# Altium project TIDA_050024.PrjPcb (part 1 of 3)
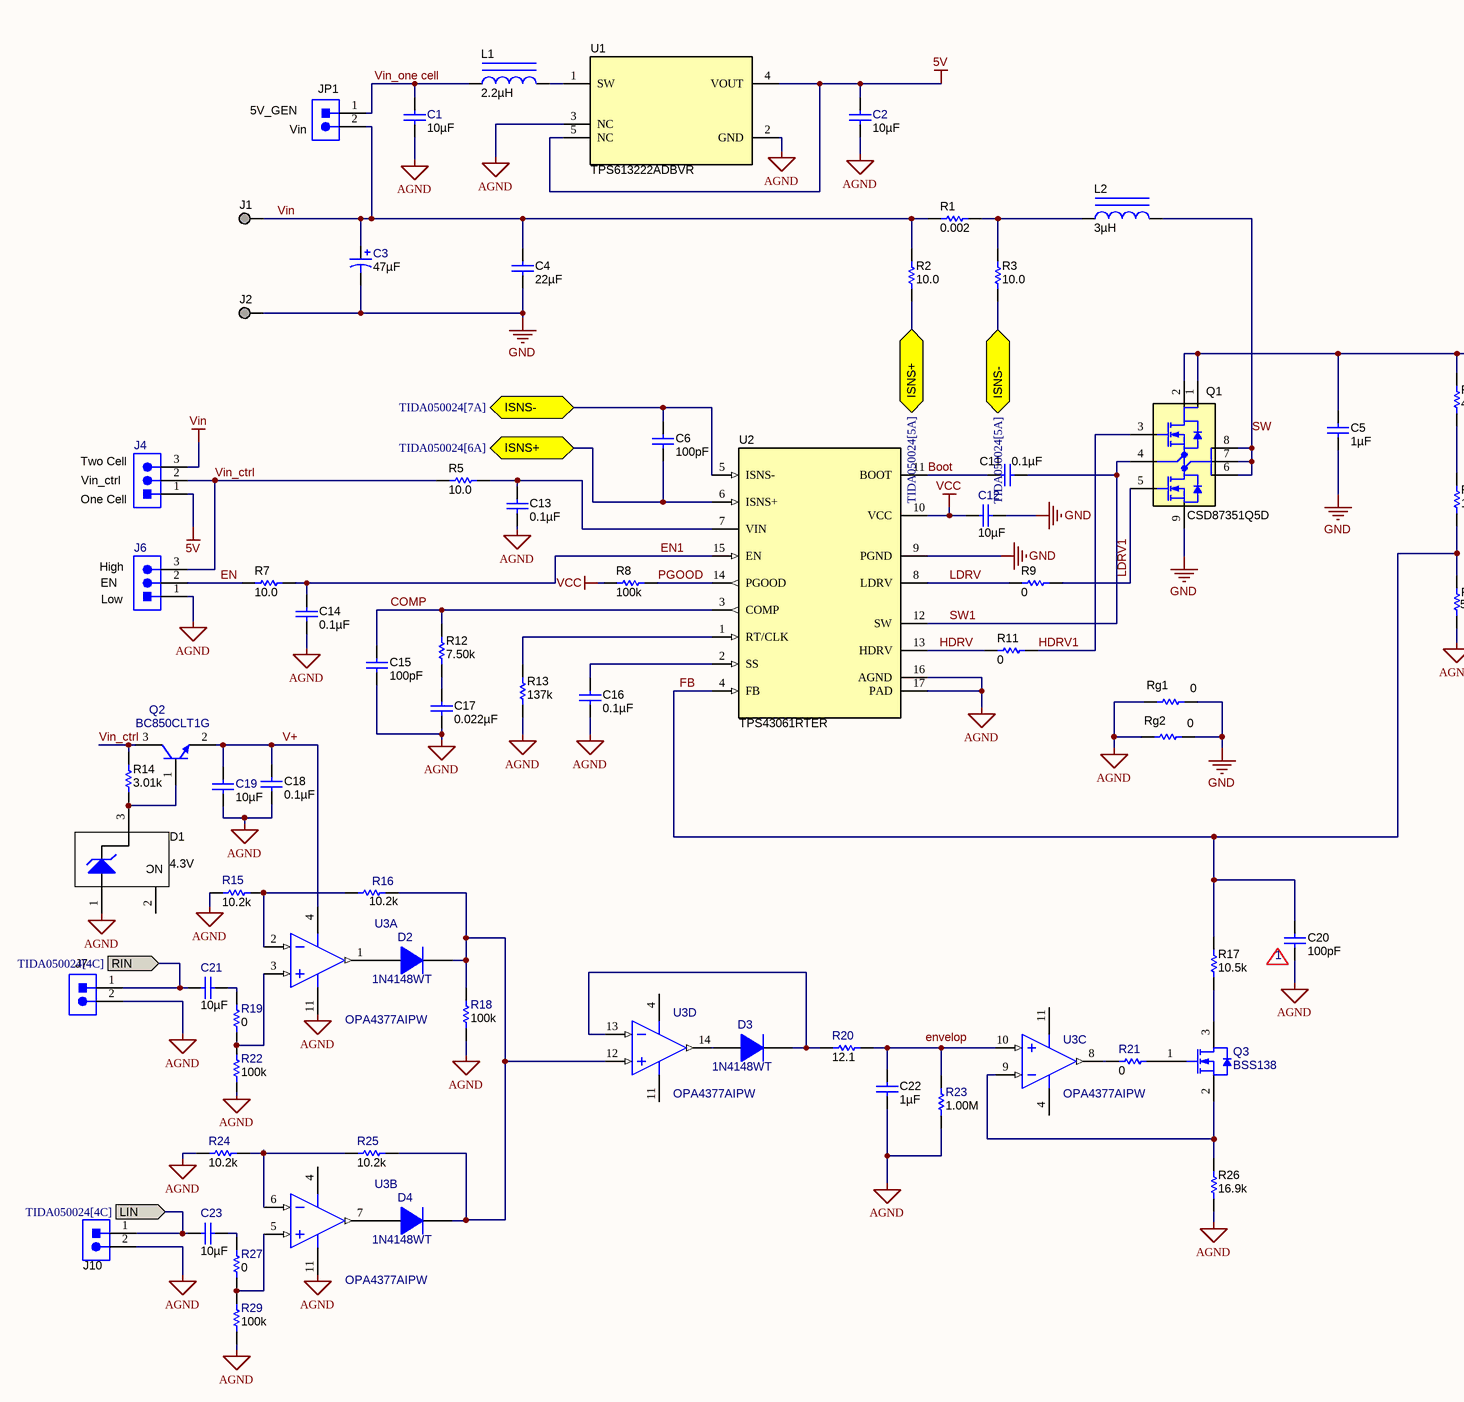
[diagram p0: TIDA050024.SchDoc, top middle]
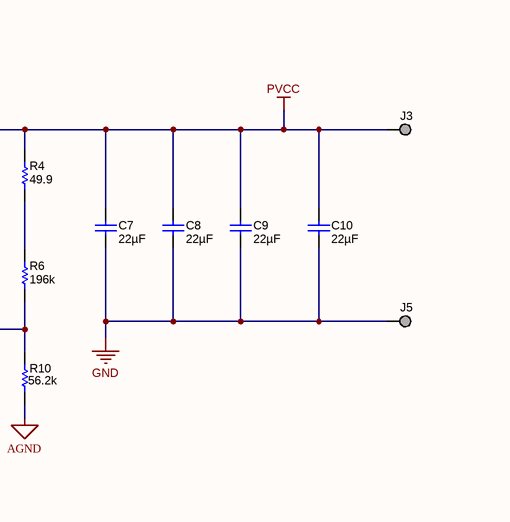
[diagram p1: TIDA050024.SchDoc, top right]
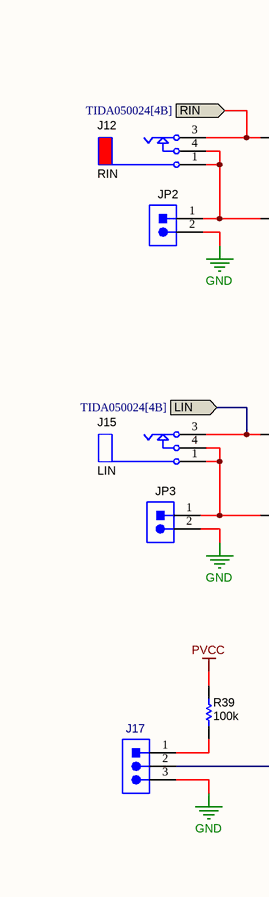
[diagram p2: TIDA050024.SchDoc, bottom left]
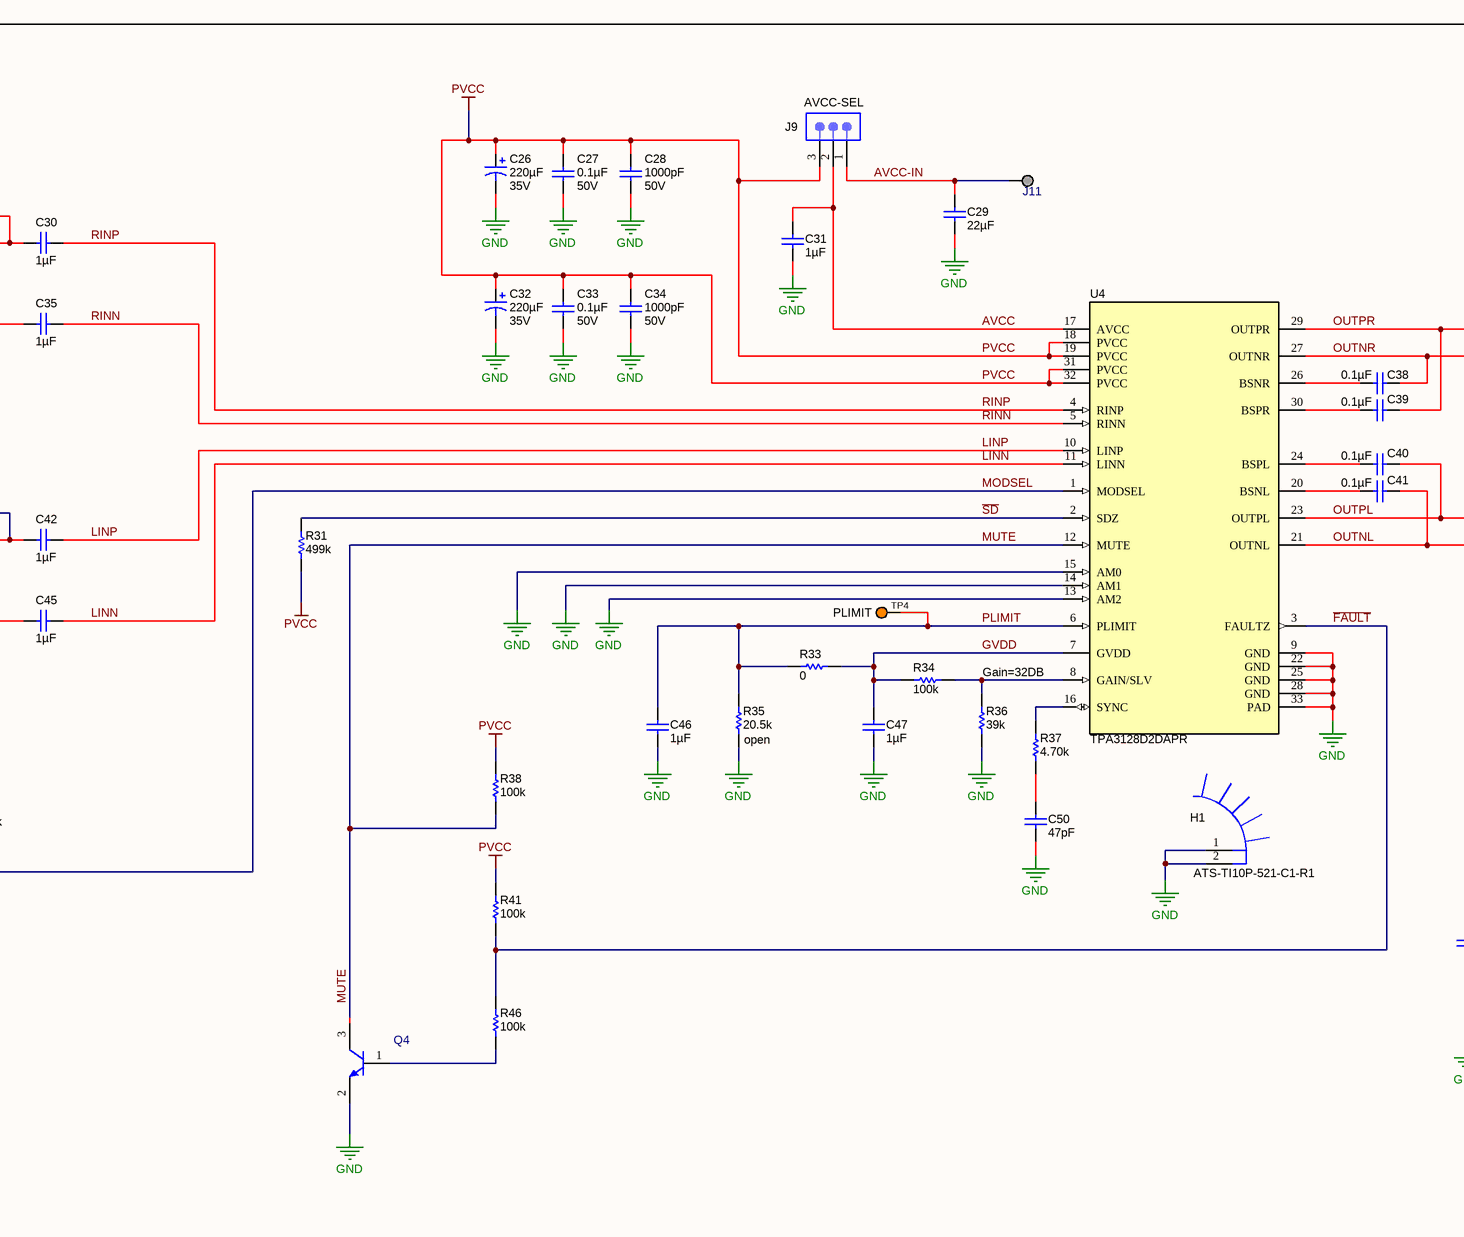
[diagram p3: TIDA050024.SchDoc, bottom middle]
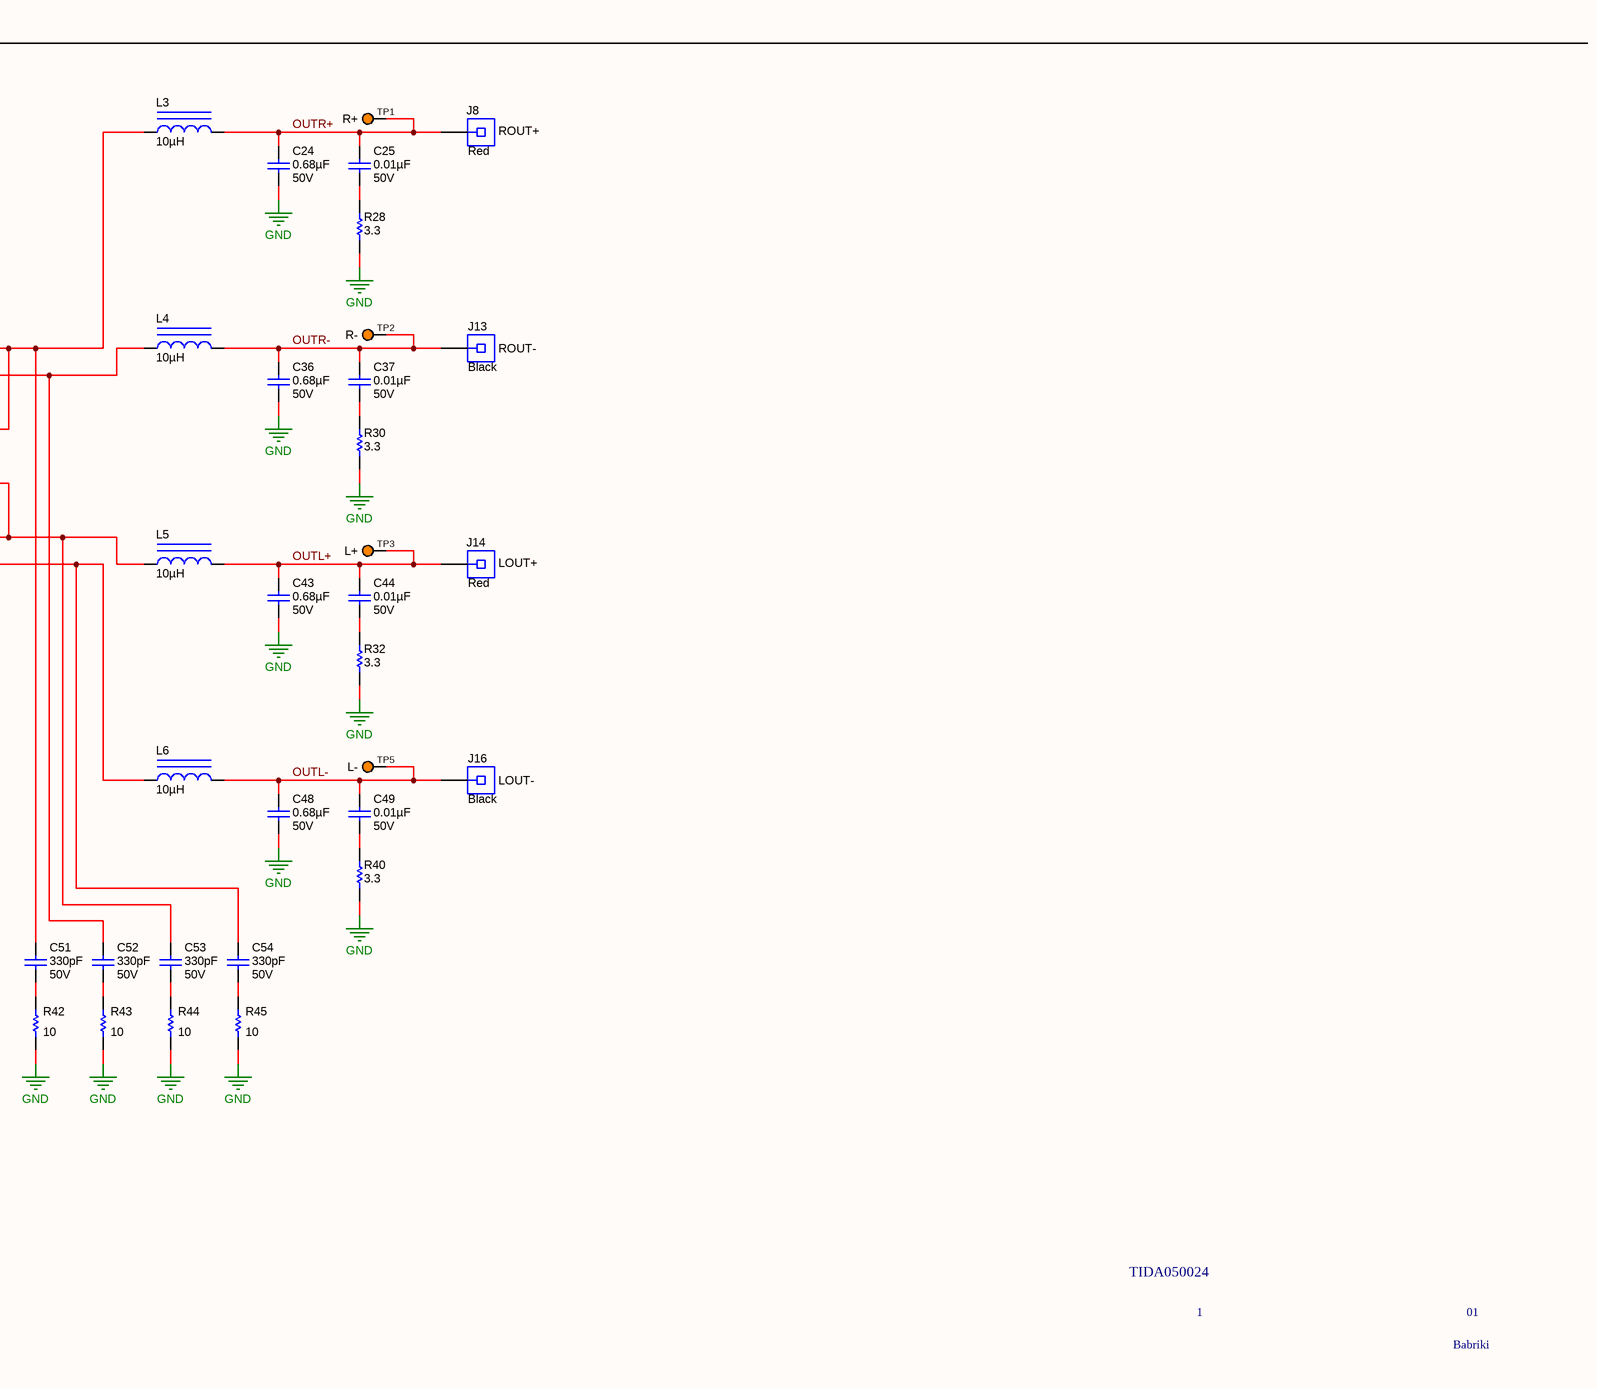
[diagram p4: TIDA050024.SchDoc, bottom right]
1 sheet, 146 parts. Net scope: flat (ports and power ports of the same name join across sheets).
Board file: TIDA050024.PcbDoc

## Sheet TIDA050024.SchDoc
size A1; SheetNumber: 1; SheetTotal: 1

### Parts
C1  ValueDisplayed: 10µF  [0603]  (hidden comment: GRM188R61E106MA73D)
C2  ValueDisplayed: 10µF  [0603]  (hidden comment: GRM188R61E106MA73D)
C3  ValueDisplayed: 47µF  [7343-31]  (hidden comment: T495D476M025ATE120)
C4  ValueDisplayed: 22µF  [1210_270]  (hidden comment: GRM32ER61E226KE15L)
C5  ValueDisplayed: 1µF  [0402]  (hidden comment: C1005X5R1E105K050BC)
C6  ValueDisplayed: 100pF  [0402]  (hidden comment: GRM1555C1H101JA01D)
C7  ValueDisplayed: 22µF  [1210_270]  (hidden comment: GRM32ER61E226KE15L)
C8  ValueDisplayed: 22µF  [1210_270]  (hidden comment: GRM32ER61E226KE15L)
C9  ValueDisplayed: 22µF  [1210_270]  (hidden comment: GRM32ER61E226KE15L)
C10  ValueDisplayed: 22µF  [1210_270]  (hidden comment: GRM32ER61E226KE15L)
C11  ValueDisplayed: 0.1µF  [0402]  (hidden comment: CGA2B3X7R1H104K050BB)
C12  ValueDisplayed: 10µF  [0603]  (hidden comment: GRM188R61E106MA73D)
C13  ValueDisplayed: 0.1µF  [0402]  (hidden comment: CGA2B3X7R1H104K050BB)
C14  ValueDisplayed: 0.1µF  [0402]  (hidden comment: CGA2B3X7R1H104K050BB)
C15  ValueDisplayed: 100pF  [0402]  (hidden comment: GRM1555C1H101JA01D)
C16  ValueDisplayed: 0.1µF  [0402]  (hidden comment: CGA2B3X7R1H104K050BB)
C17  ValueDisplayed: 0.022µF  [0402]  (hidden comment: GCM155R71E223KA55D)
C18  ValueDisplayed: 0.1µF  [0402]  (hidden comment: CGA2B3X7R1H104K050BB)
C19  ValueDisplayed: 10µF  [0603]  (hidden comment: GRM188R61E106MA73D)
C20  ValueDisplayed: 100pF  [0402]  (hidden comment: GRM1555C1H101JA01D)
C21  ValueDisplayed: 10µF  [0603]  (hidden comment: GRM188R61E106MA73D)
C22  ValueDisplayed: 1µF  [0402]  (hidden comment: C1005X5R1E105K050BC)
C23  ValueDisplayed: 10µF  [0603]  (hidden comment: GRM188R61E106MA73D)
C24  ValueDisplayed: 0.68µF  Value2: 50V  [1206L]  (hidden comment: GRM31MR71H684KA88L)
C25  ValueDisplayed: 0.01µF  Value2: 50V  [0603L]  (hidden comment: GRM188R71H103KA01D)
C26  ValueDisplayed: 220µF  Value2: 35V  [FC_1000x1250]  (hidden comment: EEU-FC1V221)
C27  ValueDisplayed: 0.1µF  Value2: 50V  [0603L]  (hidden comment: GCM188R71H104KA57D)
C28  ValueDisplayed: 1000pF  Value2: 50V  [0603L]  (hidden comment: GRM1885C1H102JA01D)
C29  ValueDisplayed: 22µF  [1210_270]  (hidden comment: GRM32ER61E226KE15L)
C30  ValueDisplayed: 1µF  [0603]  (hidden comment: GRM188R61E105KA12D)
C31  ValueDisplayed: 1µF  [0603]  (hidden comment: GRM188R61E105KA12D)
C32  ValueDisplayed: 220µF  Value2: 35V  [FC_1000x1250]  (hidden comment: EEU-FC1V221)
C33  ValueDisplayed: 0.1µF  Value2: 50V  [0603L]  (hidden comment: GCM188R71H104KA57D)
C34  ValueDisplayed: 1000pF  Value2: 50V  [0603L]  (hidden comment: GRM1885C1H102JA01D)
C35  ValueDisplayed: 1µF  [0603]  (hidden comment: GRM188R61E105KA12D)
C36  ValueDisplayed: 0.68µF  Value2: 50V  [1206L]  (hidden comment: GRM31MR71H684KA88L)
C37  ValueDisplayed: 0.01µF  Value2: 50V  [0603L]  (hidden comment: GRM188R71H103KA01D)
C38  ValueDisplayed: 0.1µF  [0603L]  (hidden comment: GCM188R71H104KA57D)
C39  ValueDisplayed: 0.1µF  [0603L]  (hidden comment: GCM188R71H104KA57D)
C40  ValueDisplayed: 0.1µF  [0603L]  (hidden comment: GCM188R71H104KA57D)
C41  ValueDisplayed: 0.1µF  [0603L]  (hidden comment: GCM188R71H104KA57D)
C42  ValueDisplayed: 1µF  [0603]  (hidden comment: GRM188R61E105KA12D)
C43  ValueDisplayed: 0.68µF  Value2: 50V  [1206L]  (hidden comment: GRM31MR71H684KA88L)
C44  ValueDisplayed: 0.01µF  Value2: 50V  [0603L]  (hidden comment: GRM188R71H103KA01D)
C45  ValueDisplayed: 1µF  [0603]  (hidden comment: GRM188R61E105KA12D)
C46  ValueDisplayed: 1µF  [0603]  (hidden comment: GRM188R61E105KA12D)
C47  ValueDisplayed: 1µF  [0603]  (hidden comment: GRM188R61E105KA12D)
C48  ValueDisplayed: 0.68µF  Value2: 50V  [1206L]  (hidden comment: GRM31MR71H684KA88L)
C49  ValueDisplayed: 0.01µF  Value2: 50V  [0603L]  (hidden comment: GRM188R71H103KA01D)
C50  ValueDisplayed: 47pF  [0603L]  (hidden comment: GRM1885C1H470JA01D)
C51  ValueDisplayed: 330pF  Value2: 50V  [0603L]  (hidden comment: GRM1885C1H331JA01D)
C52  ValueDisplayed: 330pF  Value2: 50V  [0603L]  (hidden comment: GRM1885C1H331JA01D)
C53  ValueDisplayed: 330pF  Value2: 50V  [0603L]  (hidden comment: GRM1885C1H331JA01D)
C54  ValueDisplayed: 330pF  Value2: 50V  [0603L]  (hidden comment: GRM1885C1H331JA01D)
D1  value 4.3V  [SOT-23]  (hidden comment: BZX84C4V3LT1G)
D2  1N4148WT  [Fairchild_SOD-523F]
D3  1N4148WT  [Fairchild_SOD-523F]
D4  1N4148WT  [Fairchild_SOD-523F]
H1  ATS-TI10P-521-C1-R1  [HSINK_ATS-TI10P-521-C1-R1]
J1  1502-2  [Keystone1502-2]  (value not drawn)
J2  1502-2  [Keystone1502-2]  (value not drawn)
J3  1502-2  [Keystone1502-2]  (value not drawn)
J4  TSW-103-07-G-S  [TSW-103-07-G-S]  (value not drawn)
J5  1502-2  [Keystone1502-2]  (value not drawn)
J6  TSW-103-07-G-S  [TSW-103-07-G-S]  (value not drawn)
J7  TSW-102-07-G-S  [TSW-102-07-G-S]  (value not drawn)
J8  ROUT+  Shell Color: Red  [Keystone_7006]
J9  AVCC-SEL  [PBC03SAAN]
J10  TSW-102-07-G-S  [TSW-102-07-G-S]  (value not drawn)
J11  Suggest using a net name here  [Keystone1502-2]  (value not drawn)
J12  RIN  [Keystone_971]
J13  ROUT-  Shell Color: Black  [Keystone_7007]
J14  LOUT+  Shell Color: Red  [Keystone_7006]
J15  LIN  [Keystone_970]
J16  LOUT-  Shell Color: Black  [Keystone_7007]
J17  TSW-103-07-G-S  [TSW-103-07-G-S]  (value not drawn)
JP1  TSW-102-07-G-S  [TSW-102-07-G-S]  (value not drawn)
JP2  TSW-102-07-G-S  [TSW-102-07-G-S]  (value not drawn)
JP3  TSW-102-07-G-S  [TSW-102-07-G-S]  (value not drawn)
L1  ValueDisplayed: 2.2µH  [DFE252012C]  (hidden comment: DFE252012F-2R2M=P2)
L2  ValueDisplayed: 3µH  [XAL1350]  (hidden comment: XAL1350-302MEB)
L3  ValueDisplayed: 10µH  [SRT8045]  (hidden comment: SRT8045-103MEB)
L4  ValueDisplayed: 10µH  [SRT8045]  (hidden comment: SRT8045-103MEB)
L5  ValueDisplayed: 10µH  [SRT8045]  (hidden comment: SRT8045-103MEB)
L6  ValueDisplayed: 10µH  [SRT8045]  (hidden comment: SRT8045-103MEB)
Q1  CSD87351Q5D  [DQY0008A]
Q2  BC850CLT1G  [SOT-23]
Q3  BSS138  [SOT-23]
Q4  BC850CLT1G  [SOT-23]  (value not drawn)
R1  ValueDisplayed: 0.002  [2512]  (hidden comment: CSNL2512FT2L00)
R2  ValueDisplayed: 10.0  [0402]  (hidden comment: CRCW040210R0FKED)
R3  ValueDisplayed: 10.0  [0402]  (hidden comment: CRCW040210R0FKED)
R4  ValueDisplayed: 49.9  [0402]  (hidden comment: CRCW040249R9FKED)
R5  ValueDisplayed: 10.0  [0402]  (hidden comment: CRCW040210R0FKED)
R6  ValueDisplayed: 196k  [0402]  (hidden comment: CRCW0402196KFKED)
R7  ValueDisplayed: 10.0  [0402]  (hidden comment: CRCW040210R0FKED)
R8  ValueDisplayed: 100k  [0402]  (hidden comment: CRCW0402100KFKED)
R9  ValueDisplayed: 0  [0603]  (hidden comment: RCS06030000Z0EA)
R10  ValueDisplayed: 56.2k  [0402]  (hidden comment: CRCW040256K2FKED)
R11  ValueDisplayed: 0  [0603]  (hidden comment: RCS06030000Z0EA)
R12  ValueDisplayed: 7.50k  [0402]  (hidden comment: CRCW04027K50FKED)
R13  ValueDisplayed: 137k  [0402]  (hidden comment: CRCW0402137KFKED)
R14  ValueDisplayed: 3.01k  [0402]  (hidden comment: CRCW04023K01FKED)
R15  ValueDisplayed: 10.2k  [0402]  (hidden comment: CRCW040210K2FKED)
R16  ValueDisplayed: 10.2k  [0402]  (hidden comment: CRCW040210K2FKED)
R17  ValueDisplayed: 10.5k  [0603]  (hidden comment: CRCW060310K5FKEA)
R18  ValueDisplayed: 100k  [0402]  (hidden comment: CRCW0402100KDHEDP)
R19  ValueDisplayed: 0  [0402]  (hidden comment: CRCW04020000Z0ED)
R20  ValueDisplayed: 12.1  [0402]  (hidden comment: CRCW040212R1FKED)
R21  ValueDisplayed: 0  [0402]  (hidden comment: CRCW04020000Z0ED)
R22  ValueDisplayed: 100k  [0402]  (hidden comment: CRCW0402100KDHEDP)
R23  ValueDisplayed: 1.00M  [0402]  (hidden comment: ERJ-2RKF1004X)
R24  ValueDisplayed: 10.2k  [0402]  (hidden comment: CRCW040210K2FKED)
R25  ValueDisplayed: 10.2k  [0402]  (hidden comment: CRCW040210K2FKED)
R26  ValueDisplayed: 16.9k  [0402]  (hidden comment: CRCW040216K9FKED)
R27  ValueDisplayed: 0  [0402]  (hidden comment: CRCW04020000Z0ED)
R28  ValueDisplayed: 3.3  [0603L]  (hidden comment: CRCW06033R30JNEA)
R29  ValueDisplayed: 100k  [0402]  (hidden comment: CRCW0402100KDHEDP)
R30  ValueDisplayed: 3.3  [0603L]  (hidden comment: CRCW06033R30JNEA)
R31  ValueDisplayed: 499k  [0603L]  (hidden comment: RC0603FR-07499KL)
R32  ValueDisplayed: 3.3  [0603L]  (hidden comment: CRCW06033R30JNEA)
R33  ValueDisplayed: 0  [0402]  (hidden comment: ERJ-2GE0R00X)
R34  value 100k  [0603L]  (hidden comment: RC0603FR-07100KL)
R35  ValueDisplayed: 20.5k  [0402]  (hidden comment: CRCW040220K5FKED)
R36  ValueDisplayed: 39k  [0402]  (hidden comment: CRCW040239K0JNED)
R37  ValueDisplayed: 4.70k  [0603L]  (hidden comment: RG1608P-472-B-T5)
R38  value 100k  [0603L]  (hidden comment: RC0603FR-07100KL)
R39  value 100k  [0603L]  (hidden comment: RC0603FR-07100KL)
R40  ValueDisplayed: 3.3  [0603L]  (hidden comment: CRCW06033R30JNEA)
R41  value 100k  [0603L]  (hidden comment: RC0603FR-07100KL)
R42  ValueDisplayed: 10  [0805_KTR]  (hidden comment: CRCW080510R0JNEA)
R43  ValueDisplayed: 10  [0805_KTR]  (hidden comment: CRCW080510R0JNEA)
R44  ValueDisplayed: 10  [0805_KTR]  (hidden comment: CRCW080510R0JNEA)
R45  ValueDisplayed: 10  [0805_KTR]  (hidden comment: CRCW080510R0JNEA)
R46  value 100k  [0603L]  (hidden comment: RC0603FR-07100KL)
Rg1  ValueDisplayed: 0  [0402]  (hidden comment: CRCW04020000Z0ED)
Rg2  ValueDisplayed: 0  [0402]  (hidden comment: CRCW04020000Z0ED)
TP1  R+  [Keystone5003]
TP2  R-  [Keystone5003]
TP3  L+  [Keystone5003]
TP4  PLIMIT  [Keystone5003]
TP5  L-  [Keystone5003]
U1  TPS613222ADBVR  [DBV0005A_N]
U2  TPS43061RTER  [RTE0016E]
U3  OPA4377AIPW  [PW0014A_N]  (parts A,B,C,D of 4)
U4  TPA3128D2DAPR  [DAP0032A_N]

### Ports
ISNS+ (bidir, see TIDA050024[5A]), ISNS+ (bidir, see TIDA050024[6A]), ISNS- (bidir, see TIDA050024[5A]), ISNS- (bidir, see TIDA050024[7A]), LIN (in, see TIDA050024[4B]), LIN (in, see TIDA050024[4C]), RIN (in, see TIDA050024[4B]), RIN (in, see TIDA050024[4C])

### Nets
5V: C2.1 J4.1 U1.4(VOUT) U1.5(NC)
AGND: C1.2 C2.2 C13.2 C14.2 C15.2 C16.2 C17.2 C18.2 C19.2 C20.2 C22.2 D1.1(A) J6.1 J7.2 J10.2 R10.1 R13.1 R15.1 R18.1 R22.1 R23.1 R24.1 R26.1 R29.1 Rg1.1 Rg2.1 U1.2(GND) U1.3(NC) U2.16(AGND) U2.17(PAD) U3.11(V-)
GND: C3.2(-) C4.2 C5.2 C7.2 C8.2 C9.2 C10.2 C12.2 C24.2 C26.2(-) C27.1 C28.1 C29.2 C31.2 C32.2(-) C33.1 C34.1 C36.2 C43.2 C46.1 C47.1 C48.2 C50.2 H1.1 H1.2 J2.1 J5.1 J17.3 JP2.2 JP3.2 Q1.9(PGND) Q4.2(E) R28.1 R30.1 R32.1 R35.1 R36.1 R40.1 R42.1 R43.1 R44.1 R45.1 Rg1.2 Rg2.2 U2.9(PGND) U4.9(GND) U4.13(AM2) U4.14(AM1) U4.15(AM0) U4.22(GND) U4.25(GND) U4.28(GND) U4.33(PAD)
PVCC: C5.1 C7.1 C8.1 C9.1 C10.1 C26.1(+) C27.2 C28.2 C32.1(+) C33.2 C34.2 J3.1 J9.3 Q1.1(VIN) Q1.2(VIN) R4.2 R31.2 R38.1 R39.2 R41.1 U4.18(PVCC) U4.19(PVCC) U4.31(PVCC) U4.32(PVCC)
VCC: C12.1 R8.1 U2.10(VCC)
Vin: C3.1(+) C4.1 J1.1 J4.3 JP1.2 R1.1 R2.2
~{FAULT}: R41.2 R46.1 U4.3(FAULTZ)
~{SD}: R31.1 U4.2(SDZ)
AVCC: C31.1 J9.2 U4.17(AVCC)
AVCC-IN: C29.1 J9.1 J11.1
Boot: C11.2 U2.11(BOOT)
COMP: C15.1 R12.2 U2.3(COMP)
EN: J6.2 R7.2
EN1: C14.1 R7.1 U2.15(EN)
FB: C20.1 R6.1 R10.2 R17.2 U2.4(FB)
GVDD: C47.2 R33.2 R34.1 U4.7(GVDD)
HDRV: R11.1 U2.13(HDRV)
HDRV1: Q1.3(TG) R11.2
LDRV: R9.1 U2.8(LDRV)
LDRV1: Q1.5(BG) R9.2
LINN: C45.2 U4.11(LINN)
LINP: C42.2 U4.10(LINP)
MODSEL: J17.2 U4.1(MODSEL)
MUTE: Q4.3(C) R38.2 U4.12(MUTE)
OUTL+: C43.1 C44.1 J14.1 L5.2 TP3.1
OUTL-: C48.1 C49.1 J16.1 L6.2 TP5.1
OUTNL: C41.1 C54.2 L6.1 U4.21(OUTNL)
OUTNR: C38.1 C52.2 L4.1 U4.27(OUTNR)
OUTPL: C40.1 C53.2 L5.1 U4.23(OUTPL)
OUTPR: C39.1 C51.2 L3.1 U4.29(OUTPR)
OUTR+: C24.1 C25.1 J8.1 L3.2 TP1.1
OUTR-: C36.1 C37.1 J13.1 L4.2 TP2.1
PGOOD: R8.2 U2.14(PGOOD)
PLIMIT: C46.2 R33.1 R35.2 TP4.1 U4.6(PLIMIT)
RINN: C35.2 U4.5(RINN)
RINP: C30.2 U4.4(RINP)
SW: L2.2 Q1.6(VSW) Q1.7(VSW) Q1.8(VSW)
SW1: C11.1 Q1.4(TGR) U2.12(SW)
V+: C18.1 C19.1 Q2.2(E) U3.4(V+)
Vin_ctrl: J4.2 J6.3 Q2.3(C) R5.2 R14.2
Vin_one cell: C1.1 JP1.1 L1.1
NetC6_1: C6.1 R3.1 U2.5(ISNS-) ; port ISNS-
NetC6_2: C6.2 R2.1 U2.6(ISNS+) ; port ISNS+
NetC13_1: C13.1 R5.1 U2.7(VIN)
NetC16_1: C16.1 U2.2(SS)
NetC17_1: C17.1 R12.1
NetC21_1: C21.1 C30.1 J7.1 J12.3(TIP) ; port RIN
NetC21_2: C21.2 R19.2
NetC22_1: C22.1 R20.2 R23.2 U3.10(IN_C+)
NetC23_1: C23.1 C42.1 J10.1 J15.3(TIP) ; port LIN
NetC23_2: C23.2 R27.2
NetC25_2: C25.2 R28.2
NetC35_1: C35.1 J12.1(SLEEVE) J12.4(TIP_SWITCH) JP2.1
NetC37_2: C37.2 R30.2
NetC38_2: C38.2 U4.26(BSNR)
NetC39_2: C39.2 U4.30(BSPR)
NetC40_2: C40.2 U4.24(BSPL)
NetC41_2: C41.2 U4.20(BSNL)
NetC44_2: C44.2 R32.2
NetC45_1: C45.1 J15.1(SLEEVE) J15.4(TIP_SWITCH) JP3.1
NetC49_2: C49.2 R40.2
NetC50_1: C50.1 R37.1
NetC51_1: C51.1 R42.2
NetC52_1: C52.1 R43.2
NetC53_1: C53.1 R44.2
NetC54_1: C54.1 R45.2
NetD1_3: D1.3(K) Q2.1(B) R14.1
NetD2_1: D2.1(K) D4.1(K) R16.2 R18.2 R25.2 U3.12(IN_D+)
NetD2_2: D2.2(A) U3.1(OUT_A)
NetD3_1: D3.1(K) R20.1 U3.13(IN_D-)
NetD3_2: D3.2(A) U3.14(OUT_D)
NetD4_2: D4.2(A) U3.7(OUT_B)
NetJ17_1: J17.1 R39.1
NetL1_2: L1.2 U1.1(SW)
NetL2_1: L2.1 R1.2 R3.2
NetQ3_1: Q3.1(G) R21.1
NetQ3_2: Q3.2(S) R26.2 U3.9(IN_C-)
NetQ3_3: Q3.3(D) R17.1
NetQ4_1: Q4.1(B) R46.2
NetR4_1: R4.1 R6.2
NetR13_2: R13.2 U2.1(RT/CLK)
NetR15_2: R15.2 R16.1 U3.2(IN_A-)
NetR19_1: R19.1 R22.2 U3.3(IN_A+)
NetR21_2: R21.2 U3.8(OUT_C)
NetR24_2: R24.2 R25.1 U3.6(IN_B-)
NetR27_1: R27.1 R29.2 U3.5(IN_B+)
NetR34_2: R34.2 R36.2 U4.8(GAIN/SLV)
NetR37_2: R37.2 U4.16(SYNC)

Not connected (* = marked no-connect by the designer): D1 2(NC)

### Notes on the sheet
- (near JP1) 5V_GEN
- (near JP1) Vin
- (near J4) Vin_ctrl
- (near J4) One Cell
- (near J4) Two Cell
- (near J6) EN
- (near J6) High
- (near J6) Low
- (near C20) 1
- Gain=32DB
- (near R35) open
- TIDA050024
- 1
- Babriki
- 01
- Labels drawn without touching a wire or pin: envelop